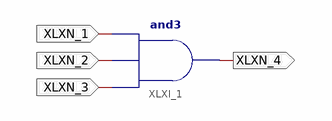
[diagram p0: schematic sheet 1]
// Xilinx ISE schematic testISIM.sch (xbr) as structural Verilog: 1 symbols, 4 ports
module testISIM (
  input  XLXN_1,
  input  XLXN_2,
  input  XLXN_3,
  output XLXN_4
);

  and XLXI_1 (XLXN_4, XLXN_3, XLXN_2, XLXN_1);
endmodule
